# Altium project Mirror TurnSignal.PrjPcb
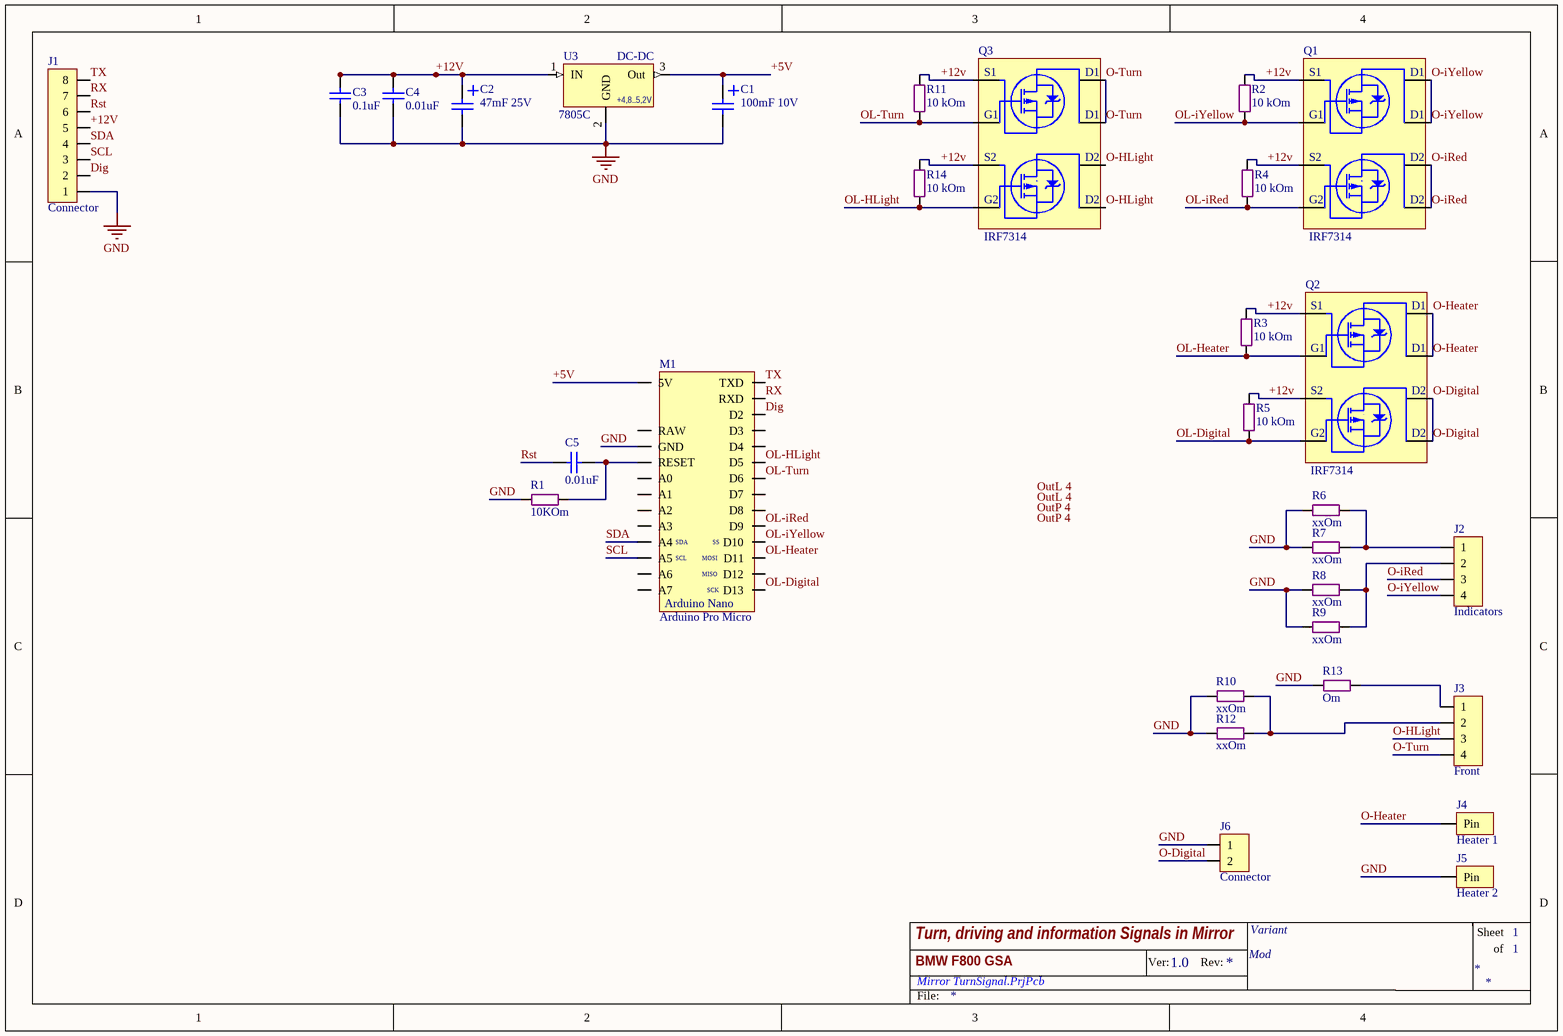
[diagram p0: Mirror TurnSignal.SchDoc]
1 sheet, 30 parts. Net scope: global (net labels, ports and power ports of the same name join across sheets).
Board file: Mirror TurnSignal.PcbDoc

## Sheet Mirror TurnSignal.SchDoc: Turn, driving and information Signals in Mirror
size A4; SheetNumber: 1; SheetTotal: 1; Version: 1.0; Variant: Variant; Modification: Mod; Project: BMW F800 GSA

### Parts
C1  100mF 10V  [Cap E p1.5mm D4xH8 (2p)]
C2  47mF 25V  [Cap E p1.5mm D4xH8 (2p)]
C3  0.1uF  [SMD 0805 (2012)]
C4  0.01uF  [SMD 0805 (2012)]
C5  0.01uF  [SMD 0805 (2012)]
J1  Connector  [Molex Micro-Fit 3.0 - 8 pin D R]
J2  Indicators  [Molex Micro-Fit 3.0 - 4 pin D]
J3  Front  [Molex Micro-Fit 3.0 - 4 pin D]
J4  Heater 1  [OnePin 3x10mm]
J5  Heater 2  [OnePin 3x10mm]
J6  Connector  [Molex Micro-Fit 3.0 - 2 pin D]
M1  Arduino Pro Micro  [Arduino Pro Mini Low (no A0-3)]
Q1  IRF7314  [SO8]  (value not drawn)
Q2  IRF7314  [SO8]  (value not drawn)
Q3  IRF7314  [SO8]  (value not drawn)
R1  10KOm  [SMD 0805 (2012)]
R2  10 kOm  [SMD 0805 (2012)]
R3  10 kOm  [SMD 0805 (2012)]
R4  10 kOm  [SMD 0805 (2012)]
R5  10 kOm  [SMD 0805 (2012)]
R6  xxOm  [Res p5 (3p) 2w]
R7  xxOm  [Res p5 (3p) 2w]
R8  xxOm  [Res p5 (3p) 2w]
R9  xxOm  [Res p5 (3p) 2w]
R10  xxOm  [Res p5 (3p) 2w]
R11  10 kOm  [SMD 0805 (2012)]
R12  xxOm  [Res p5 (3p) 2w]
R13  Om  [Res 5W L22mm, p25mm]
R14  10 kOm  [SMD 0805 (2012)]
U3  7805C  V Out: +4,8..5,2V  [D-PAK]

### Nets
GND: C1.2 C2.2 C3.2 C4.2 J1.1 J5.1(Pin) J6.1 M1.GND R1.1 R6.1 R7.1 R8.1 R9.1 R10.1 R12.2 R13.1 U3.2(GND)
+5V: C1.1 M1.5V U3.3(Out)
+12v: C2.1 C3.1 C4.1 J1.5 Q1.1(S) Q1.3(S) Q2.1(S) Q2.3(S) Q3.1(S) Q3.3(S) R2.2 R3.2 R4.2 R5.2 R11.2 R14.2 U3.1(IN)
Dig: J1.2 M1.D2
O-Digital: J6.2 Q2.5(D) Q2.6(D)
O-Heater: J4.1(Pin) Q2.7(D) Q2.8(D)
O-HLight: J3.3 Q3.5(D) Q3.6(D)
O-iRed: J2.3 Q1.5(D) Q1.6(D)
O-iYellow: J2.4 Q1.7(D) Q1.8(D)
O-Turn: J3.4 Q3.7(D) Q3.8(D)
OL-Digital: M1.D13 Q2.4(G) R5.1
OL-Heater: M1.D11 Q2.2(G) R3.1
OL-HLight: M1.D5 Q3.4(G) R14.1
OL-iRed: M1.D9 Q1.4(G) R4.1
OL-iYellow: M1.D10 Q1.2(G) R2.1
OL-Turn: M1.D6 Q3.2(G) R11.1
Rst: C5.1 J1.6
RX: J1.7 M1.RXD
SCL: J1.3 M1.A5
SDA: J1.4 M1.A4
TX: J1.8 M1.TXD
NetC5_2: C5.2 M1.RESET R1.2
NetJ2_1: J2.1 R6.2 R7.2
NetJ2_2: J2.2 R8.2 R9.2
NetJ3_1: J3.1 R13.2
NetJ3_2: J3.2 R10.2 R12.1

Not connected (* = marked no-connect by the designer): M1 A0 A1 A2 A3 A6 A7 D3 D4 D7 D8 D12 RAW

### Notes on the sheet
- (near U3) DC-DC
- Labels drawn without touching a wire or pin: OutL 4, OutP 4
- Ver:
- Rev:
- Sheet
- of
- File:
- (in symbol Arduino Pro Micro) SDA; SS; SCL; MOSI; MISO; SCK; Arduino Nano
- (in symbol IRF7314) S1; D1; G1; S2; D2; G2

### Library data of the parts
C1 = Cap E 100mF x 10V: Capacitor
C2 = Cap E 47mF x 25V: Capacitor
C3-C5 = Cap SMD 0402-1812: Capacitor
J1 = Micro-Fit 8R (2x4): Horisontal, Dbl line, Male - 3mm
J2 J3 = Micro-Fit 4R (2x2): Horisontal, Dbl line, Male - 3mm; Part Number: 0430450402; Name: Micro-Fit 3.0; URL: http://www.molex.com/molex/products/datasheet.jsp?part=active/0430450402_PCB_HEADERS.xml
J4 J5 = OnePin Connector: Only pad
J6 = Micro-Fit 2R (1x2): Horisontal, Dbl line, Male - 3mm; Part Number: 430450200; Name: Micro-Fit 3.0; URL: http://www.molex.com/molex/products/datasheet.jsp?part=active/0430450200_PCB_HEADERS.xml
Q1-Q3 = IRF7314: Dual P-Ch  20V - 0.058Ω - 5.3A; Monufacturer: IOR; RDS Сопротивление Сток-Исток: 0.058 Om; I d - Drain current (continuous) at TC = 100°C: 4.3 A; VGS Порог Открытия: -0.7 V; VGS Макс напр на гейте: +-12 V; C ISS Входная емкость: 780 pF; C OSS Выходная емкость: 470 pF; V DSS (v): 20V; I d - Drain current (continuous) at TC = 25°C: 5.3 A; Name: IRF7314; Datasheet: http://tec.org.ru/_bd/2/277_IRF7314-IR.pdf; URL: http://tec.org.ru/board/49-1-0-277
R1-R5 R11 R14 = Res All Types
R6-R10 R12 = Res 2W: 5W Cement
R13 = Res 5W: 5W Cement
U3 = 7805C: Voltage Regulator; Manufacturer: Интеграл; I output (A): 1; Max Voltage In (V): 35; Напряжение выход-вход (dropout): >2V; t: -10..+70°C; Case: D2PAK; Shema: http://tec.org.ru/_bd/5/57349922.jpg; Name: 7805C